# Altium schematic sheet KNOBS.SchDoc
size A4; SheetNumber: 3; SheetTotal: 5
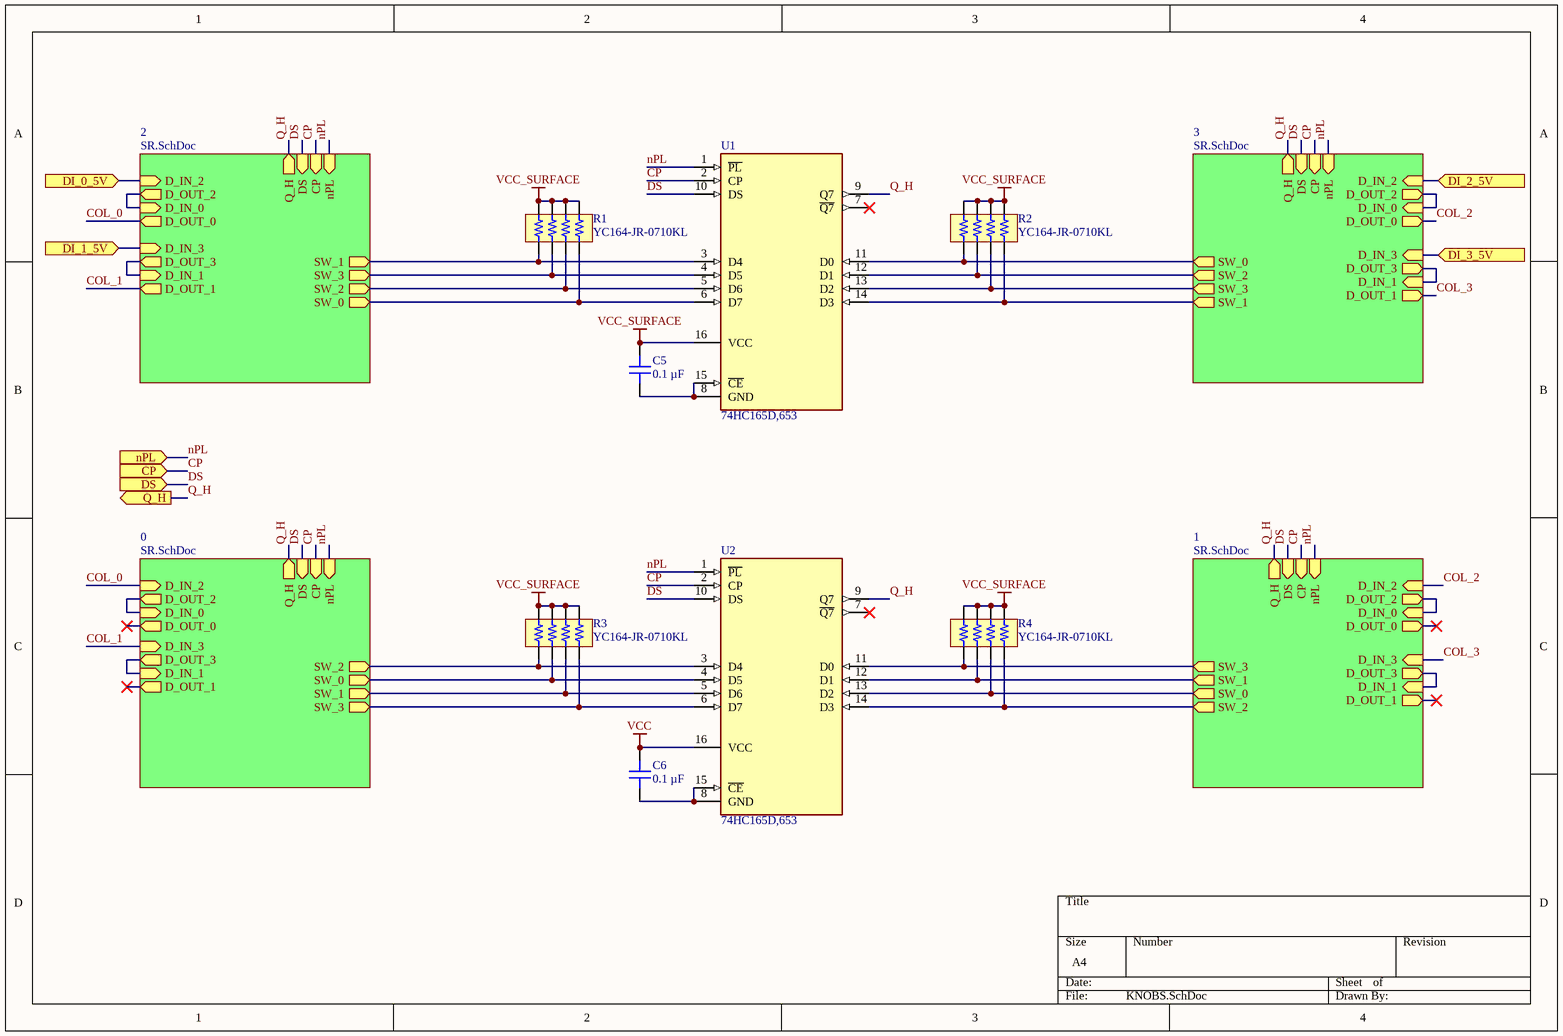
[diagram p0: KNOBS.SchDoc]

## Parts
C5  0.1 µF  [CAP 0603_1608]
C6  0.1 µF  [CAP 0603_1608]
R1  YC164-JR-0710KL  [RESNET 1206-8 CONVEX]
R2  YC164-JR-0710KL  [RESNET 1206-8 CONVEX]
R3  YC164-JR-0710KL  [RESNET 1206-8 CONVEX]
R4  YC164-JR-0710KL  [RESNET 1206-8 CONVEX]
U1  74HC165D,653  [FP-SOT109-1-MFG]
U2  74HC165D,653  [FP-SOT109-1-MFG]

## Sub-sheets
0 = SR.SchDoc: SW_0 (out), D_IN_0 (in), D_OUT_0 (out), SW_3 (out), D_IN_3 (in), D_OUT_3 (out), SW_2 (out), D_IN_2 (in), D_OUT_2 (out), SW_1 (out), D_IN_1 (in), D_OUT_1 (out), nPL (in), CP (in), DS (in), Q_H (out)
1 = SR.SchDoc: SW_0 (out), D_IN_0 (in), D_OUT_0 (out), SW_3 (out), D_IN_3 (in), D_OUT_3 (out), SW_2 (out), D_IN_2 (in), D_OUT_2 (out), SW_1 (out), D_IN_1 (in), D_OUT_1 (out), nPL (in), CP (in), DS (in), Q_H (out)
2 = SR.SchDoc: SW_0 (out), D_IN_0 (in), D_OUT_0 (out), SW_3 (out), D_IN_3 (in), D_OUT_3 (out), SW_2 (out), D_IN_2 (in), D_OUT_2 (out), SW_1 (out), D_IN_1 (in), D_OUT_1 (out), nPL (in), CP (in), DS (in), Q_H (out)
3 = SR.SchDoc: SW_0 (out), D_IN_0 (in), D_OUT_0 (out), SW_3 (out), D_IN_3 (in), D_OUT_3 (out), SW_2 (out), D_IN_2 (in), D_OUT_2 (out), SW_1 (out), D_IN_1 (in), D_OUT_1 (out), nPL (in), CP (in), DS (in), Q_H (out)

## Ports
CP (in), DI_0_5V (in), DI_1_5V (in), DI_2_5V (in), DI_3_5V (in), DS (in), nPL (in), Q_H (out)

## Nets
VCC: C6.2 U2.16(VCC)
VCC_SURFACE: C5.2 R1.5 R1.6 R1.7 R1.8 R2.5 R2.6 R2.7 R2.8 R3.5 R3.6 R3.7 R3.8 R4.5 R4.6 R4.7 R4.8 U1.16(VCC)
COL_0: sheet 0/D_IN_2, sheet 2/D_OUT_0
COL_1: sheet 0/D_IN_3, sheet 2/D_OUT_1
COL_2: sheet 1/D_IN_2, sheet 3/D_OUT_0
COL_3: sheet 1/D_IN_3, sheet 3/D_OUT_1
CP: U1.2(CP) U2.2(CP) ; port CP, sheet 0/CP, sheet 1/CP, sheet 3/CP, sheet 2/CP
DI_0_5V: port DI_0_5V, sheet 2/D_IN_2
DI_1_5V: port DI_1_5V, sheet 2/D_IN_3
DI_2_5V: port DI_2_5V, sheet 3/D_IN_2
DI_3_5V: port DI_3_5V, sheet 3/D_IN_3
DS: U1.10(DS) U2.10(DS) ; port DS, sheet 0/DS, sheet 1/DS, sheet 3/DS, sheet 2/DS
nPL: U1.1(~{PL}) U2.1(~{PL}) ; port nPL, sheet 0/nPL, sheet 1/nPL, sheet 3/nPL, sheet 2/nPL
Q_H: U1.9(Q7) U2.9(Q7) ; port Q_H, sheet 0/Q_H, sheet 1/Q_H, sheet 3/Q_H, sheet 2/Q_H
NetC5_1: C5.1 U1.8(GND) U1.15(~{CE})
NetC6_1: C6.1 U2.8(GND) U2.15(~{CE})
NetR1_1: R1.1 U1.3(D4) ; sheet 2/SW_1
NetR1_2: R1.2 U1.4(D5) ; sheet 2/SW_3
NetR1_3: R1.3 U1.5(D6) ; sheet 2/SW_2
NetR1_4: R1.4 U1.6(D7) ; sheet 2/SW_0
NetR2_1: R2.1 U1.11(D0) ; sheet 3/SW_0
NetR2_2: R2.2 U1.12(D1) ; sheet 3/SW_2
NetR2_3: R2.3 U1.13(D2) ; sheet 3/SW_3
NetR2_4: R2.4 U1.14(D3) ; sheet 3/SW_1
NetR3_1: R3.1 U2.3(D4) ; sheet 0/SW_2
NetR3_2: R3.2 U2.4(D5) ; sheet 0/SW_0
NetR3_3: R3.3 U2.5(D6) ; sheet 0/SW_1
NetR3_4: R3.4 U2.6(D7) ; sheet 0/SW_3
NetR4_1: R4.1 U2.11(D0) ; sheet 1/SW_3
NetR4_2: R4.2 U2.12(D1) ; sheet 1/SW_1
NetR4_3: R4.3 U2.13(D2) ; sheet 1/SW_0
NetR4_4: R4.4 U2.14(D3) ; sheet 1/SW_2
(unnamed): sheet 0/D_IN_0, sheet 0/D_OUT_2
(unnamed): sheet 0/D_OUT_3, sheet 0/D_IN_1
(unnamed): sheet 1/D_IN_0, sheet 1/D_OUT_2
(unnamed): sheet 1/D_OUT_3, sheet 1/D_IN_1
(unnamed): sheet 3/D_IN_0, sheet 3/D_OUT_2
(unnamed): sheet 3/D_OUT_3, sheet 3/D_IN_1
(unnamed): sheet 2/D_IN_0, sheet 2/D_OUT_2
(unnamed): sheet 2/D_OUT_3, sheet 2/D_IN_1

Not connected (* = marked no-connect by the designer): U1 7(~{Q7})*; U2 7(~{Q7})*

## Library data of the parts
C5 C6 = CC0603KPX7R7BB104: CAP CER 0.1UF 16V X7R 0603; manufacturer: Yageo; Tolerance: ±10%; Part Number: CC0603KPX7R7BB104; Value: 0.1 µF; Applications: General Purpose; Capacitance: 0.1 µF; componentlink1description: Datasheet; componentlink1url: https://www.yageo.com/upload/media/product/productsearch/datasheet/mlcc/UPY-GPHC_X7R_6.3V-to-50V_18.pdf; componentlink2description: DigiKey Link; componentlink2url: https://www.digikey.com/en/products/detail/yageo/CC0603KPX7R7BB104/2103073; Device Package: 0603 (1608 Metric); lastupdated: 2/9/2024 8:10:09 PM; Lifecycle Status: Active; Minimum Order: 1; Mounting Type: Surface Mount, MLCC; Operating Temperature: -55°C ~ 125°C; Package / Case: 0603 (1608 Metric); packaging: TapeAndReel; partid: 16718; Part Status: Active; price: 0.01; series: CC; Size / Dimension: 0.063" L x 0.031" W (1.60mm x 0.80mm); Supplier 1: DigiKey; Supplier Part Number 1: 311-1335-1-ND; Temperature Coefficient: X7R; Thickness (Max): 0.035" (0.90mm); Voltage - Rated: 16V
R1-R4 = YC164-JR-0710KL: RES ARRAY 4 RES 10K OHM 1206; Manufacturer: Yageo; Circuit Type: Isolated; Number of Resistors: 4; Power Per Element: 62.5mW; Temperature Coefficient: ±200ppm/°C; Tolerance: ±5%; Part Number: YC164-JR-0710KL; Applications: DDRAM, SDRAM; ComponentLink1Description: Datasheet; ComponentLink1URL: https://www.yageo.com/upload/media/product/productsearch/datasheet/rchip/PYu-YC_TC_group_51_RoHS_L_9.pdf; ComponentLink2Description: DigiKey Link; ComponentLink2URL: http://digikey.com/product-detail/en/yageo/YC164-JR-0710KL/YC164J-10KCT-ND/1005702; Height - Seated (Max): 0.028" (0.70mm); LastUpdated: 9/2/2020 1:23:24 AM; Lifecycle Status: Active; Minimum Order: 1; Mounting Type: Surface Mount; Number of Pins: 8; Operating Temperature: -55°C ~ 155°C; Package / Case: 1206 (3216 Metric), Convex, Long Side Terminals; Packaging: TapeAndReel; PartId: 146; Part Status: Active; Price: 0.01; Resistance (Ohms): 10k; Series: YC164; Size / Dimension: 0.126" L x 0.063" W (3.20mm x 1.60mm); Supplier 1: DigiKey; Supplier Part Number 1: YC164J-10KCT-ND
U1 U2 = CMP-14351-000001-1: IC SHIFT REGST 8BIT PI-SO 16SOIC; Manufacturer: Nexperia; Standoff Height: 0.1mm; Number Of Inputs: 8; Logic Function Desc: Shift Register; Nominal Supply Current: 8uA; Number Of Circuits: 1; Propagation Delay: 15ns; Min Supply Voltage: 2V; Frequency: 61MHz; Max Supply Voltage: 6V; Height: 1.75mm; Digikey Description: IC SHIFT REGST 8BIT PI-SO 16SOIC; ComponentLink2URL: https://assets.nexperia.com/documents/data-sheet/74HC_HCT165.pdf; Ipc Land Pattern Name: SOP127P600X175-16; Temperature Range High: +125°C; Manufacturer Part Number: 74HC165D,653; Temperature: -40°C to +125°C; Device Class L2: Logic ICs; Device Class L1: Integrated Circuits (ICs); Lead Free: Yes; Number Of Outputs: 1; Ambient Temperature Range High: +125°C; ComponentLink2Description: Datasheet; Temperature Range Low: -40°C; Category: IC; RoHS: TRUE; Automotive: No; Device Class L3: Shift Registers; Octopart: https://octopart.com/74hc165d%2C653-nexperia-78737091; Footprint Url: https://assets.nexperia.com/documents/outline-drawing/SOT109-1.pdf; Ambient Temperature Range Low: -40°C; Package: SOT109-1